# Altium schematic sheet interfaces.schdoc
size 209 x 297 mm; Scale: 1:1; DocumentType: Ñõåìà ýëåêòðè÷åñêàÿ ïðèíöèïèàëüíàÿ; FirstReferrence: ÀÁÂÃ.123456.001; PageSetup: Record=PageOptions¦CenterHorizontal=False¦CenterVertical=False¦PrintScale=0.95¦XCorrection=0.00¦YCorrection=0.00¦PrintKind=1¦BorderSize=5000000¦LeftOffset=0¦BottomOffset=0¦Orientation=1¦PaperLength=1000¦PaperWidth=1000¦Scale=100¦PaperSource=15¦PrintQuality=600¦MediaType=1¦DitherType=10¦PaperKind=A4¦PrintScaleMode=1
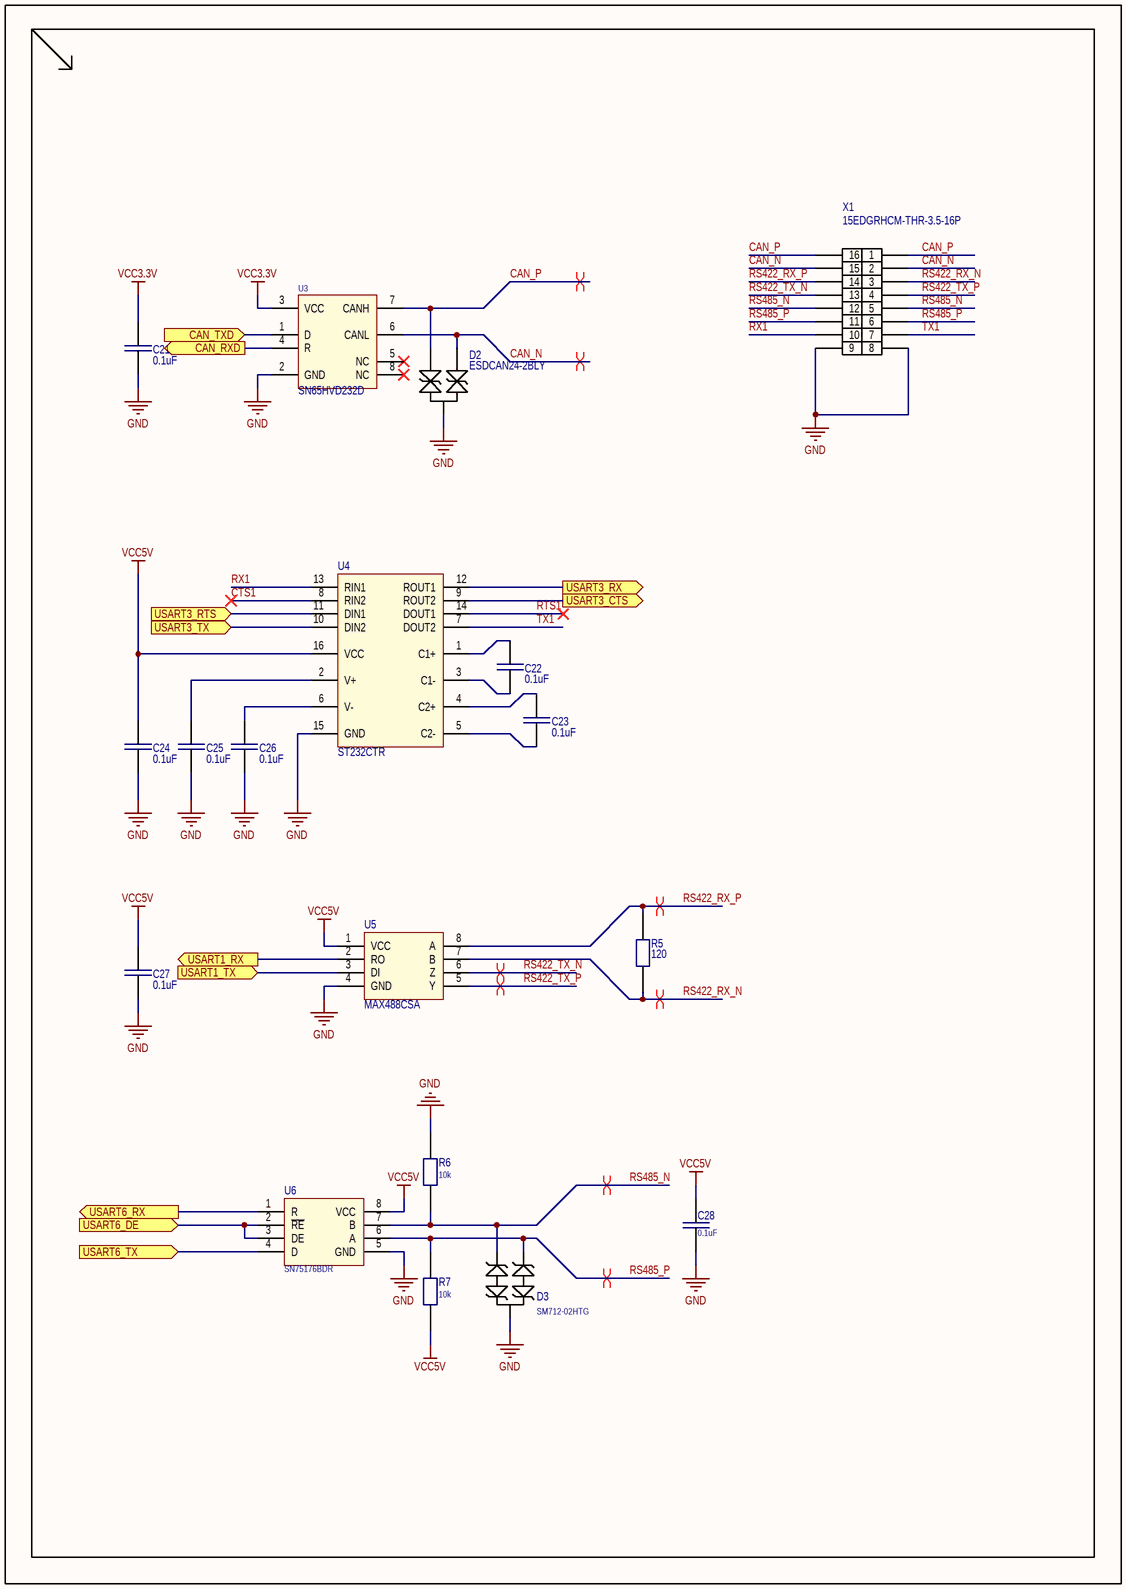
[diagram p0: interfaces.schdoc]

## Parts
C21  0.1uF  [C_0603]
C22  0.1uF  [C_0603]
C23  0.1uF  [C_0603]
C24  0.1uF  [C_0603]
C25  0.1uF  [C_0603]
C26  0.1uF  [C_0603]
C27  0.1uF  [C_0603]
C28  0.1uF  [C_0603]
D2  ESDCAN24-2BLY  [SOT23]
D3  SM712-02HTG  [SOT23]
R5  120  [R_0603]
R6  10k  [R_0603]
R7  10k  [R_0603]
U3  SN65HVD232D  [SO-8_M]
U4  ST232CTR  [TSSOP16_STM]
U5  MAX488CSA  [SO-8_M]
U6  SN75176BDR  [SO-8]
X1  15EDGRHCM-THR-3.5-16P  [DMC 1,5/ 8-G1F-3,5-LR P20THR / 1787072]

## Ports
CAN_RXD (out), CAN_TXD (in), USART1_RX (out), USART1_TX (in), USART3_CTS (out), USART3_RTS (in), USART3_RX (out), USART3_TX (in), USART6_DE (in), USART6_RX (out), USART6_TX (in)

## Nets
GND: C21.1 C24.1 C25.1 C26.1 C27.1 C28.1 D2.3 D3.3 R6.2 U3.2(GND) U4.15(GND) U5.4(GND) U6.5(GND) X1.8 X1.9
VCC3.3V: C21.2 U3.3(VCC)
VCC5V: C24.2 C27.2 C28.2 R7.1 U4.16(VCC) U5.1(VCC) U6.8(VCC)
CAN_N: D2.2 U3.6(CANL) X1.2 X1.15
CAN_P: D2.1 U3.7(CANH) X1.1 X1.16
CAN_RXD: U3.4(R) ; port CAN_RXD
CAN_TXD: U3.1(D) ; port CAN_TXD
CTS1: U4.8(RIN2)
RS422_RX_N: R5.2 U5.7(B) X1.3
RS422_RX_P: R5.1 U5.8(A) X1.14
RS422_TX_N: U5.6(Z) X1.13
RS422_TX_P: U5.5(Y) X1.4
RS485_N: D3.1 R6.1 U6.7(B) X1.5 X1.12
RS485_P: D3.2 R7.2 U6.6(A) X1.6 X1.11
RTS1: U4.14(DOUT1)
RX1: U4.13(RIN1) X1.10
TX1: U4.7(DOUT2) X1.7
USART1_RX: U5.2(RO) ; port USART1_RX
USART1_TX: U5.3(DI) ; port USART1_TX
USART3_CTS: U4.9(ROUT2) ; port USART3_CTS
USART3_RTS: U4.11(DIN1) ; port USART3_RTS
USART3_RX: U4.12(ROUT1) ; port USART3_RX
USART3_TX: U4.10(DIN2) ; port USART3_TX
USART6_DE: U6.2(~{RE}) U6.3(DE) ; port USART6_DE
USART6_RX: U6.1(R) ; port USART6_RX
USART6_TX: U6.4(D) ; port USART6_TX
NetC22_1: C22.1 U4.1(C1+)
NetC22_2: C22.2 U4.3(C1-)
NetC23_1: C23.1 U4.4(C2+)
NetC23_2: C23.2 U4.5(C2-)
NetC25_2: C25.2 U4.2(V+)
NetC26_2: C26.2 U4.6(V-)

Not connected (* = marked no-connect by the designer): U3 5(NC)* 8(NC)*

## Layout directives
differential pair: CAN_N, CAN_P, RS422_RX_N, RS422_RX_P, RS422_TX_N, RS422_TX_P, RS485_N, RS485_P

## Library data of the parts
C21 C27 C28 = CAP_SMD: Capacitor; Part Number: CC0603KPX7R9BB104; Alternative Part: *; Value: 0.1uF
C22-C26 = C0603: Capacitor; Part: CC0603KPX7R9BB104; Value: 0.1uF
D2 = ESD_CAN: ESD; Value: ESDCAN24-2BLY; Part Number: ESDCAN24-2BLY; Alternative Part: *
D3 = ESD: Value: SM712-02HTG; Part Number: SM712-02HTG; Alternative Part: *
R5 = RES_SMD: Resistor; Part Number: RC0603FR-07120RL; Alternative Part: *; Value: 120
R6 R7 = RES_SMD: Resistor; Part Number: RC0603FR-0710KL; Alternative Part: *; Value: 10k
U3 = SN65HVD232D: CAN_transiever; Part Number: SN65HVD232D; Alternative Part: *
U4 = ST232CTR: No Description Available; Mfr_Name: STMicroelectronics; Copyright: Copyright (C) 2022 Ultra Librarian. All rights reserved.; Part Number: ST232CTR; RefDes: RefDes; Type: DEV
U5 = ADM4855ARZ: RS485 Full Duplex Convertor; Part Number: MAX488CSA; Alternative Part: ADM4855ARZ
U6 = SN75176BDR: RS485 Half Duplex Convertor; Part Number: SN75176BDR
X1 = DMC 1,5/ 8-G1F-3,5-LR P20THR / 1787072: Part Number: 15EDGRHCM-THR-3.5-16P